# EasyEDA schematic 立创EDA原理图.json
TITLE: My_IOT; REV: 1.0; Date: 2020-11-04; Sheet: 1/1; Company: HNISC
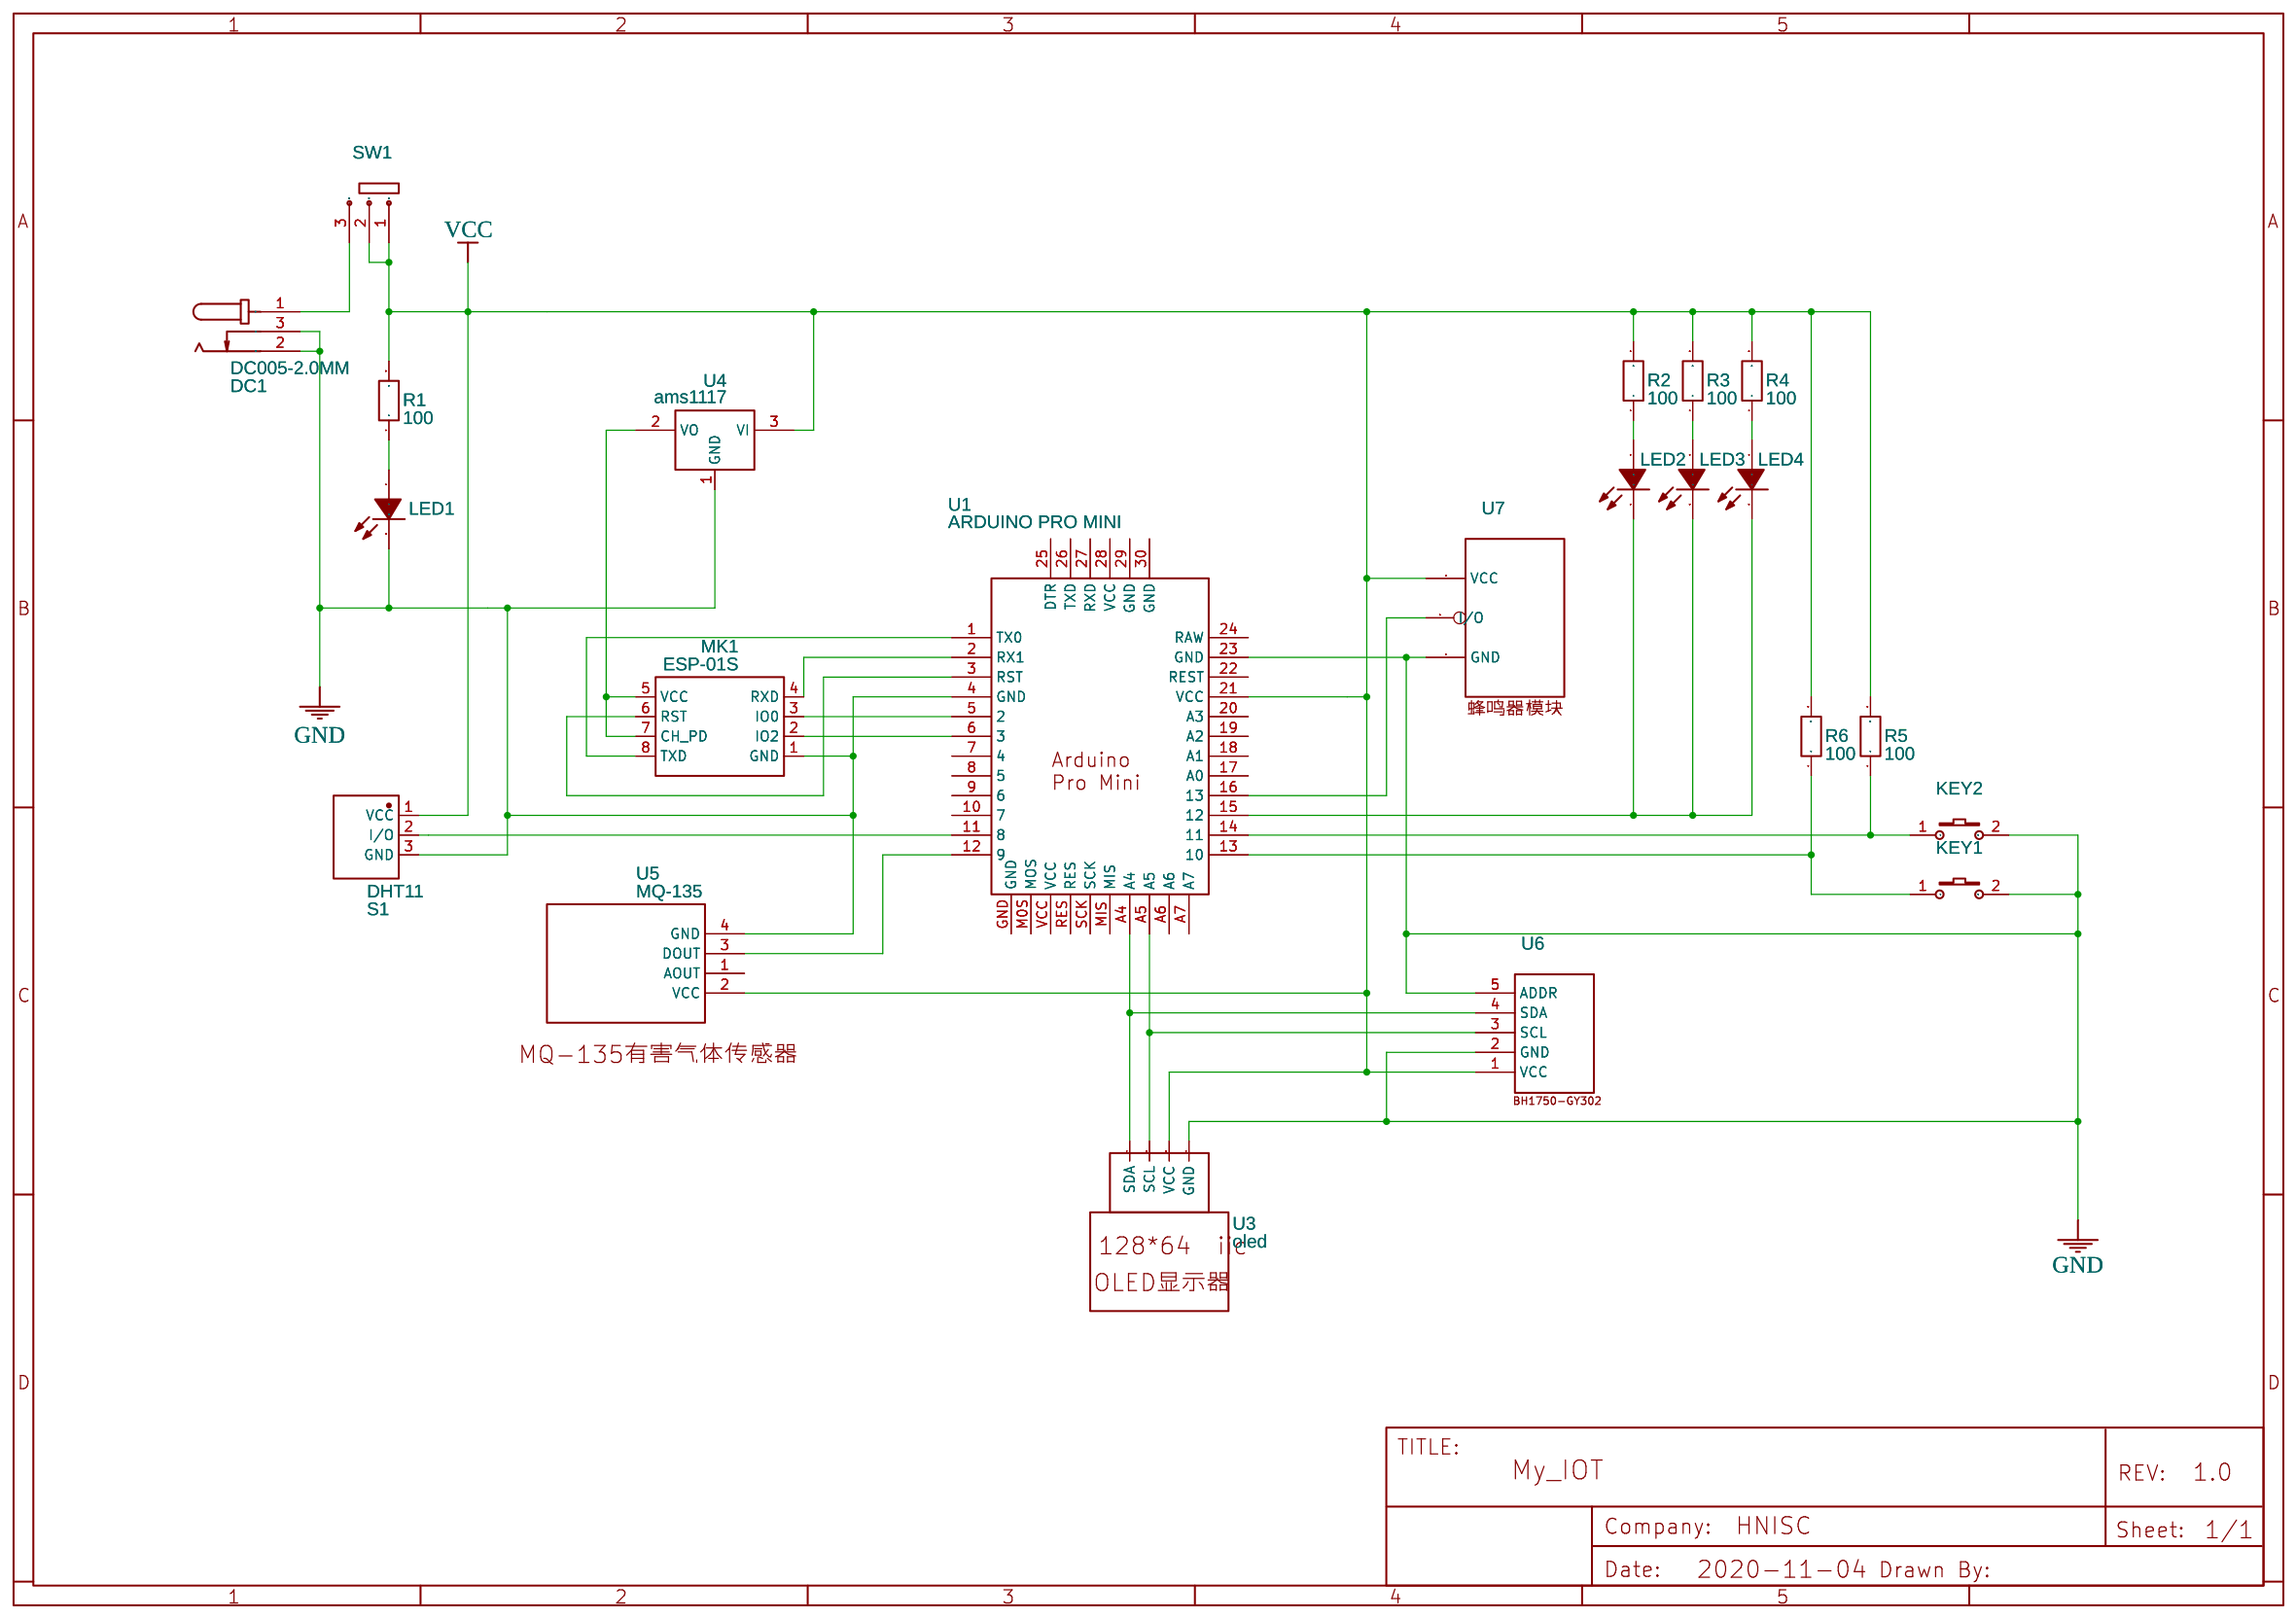
[diagram p0: schematic sheet]

## Parts
DC1  DC005-2.0MM  [DC-IN-TH_DC005]
KEY1  K2-3.6×6.1_SMD  [KEY-SMD_2P-L6.2-W3.6-LS8.0]
KEY2  K2-3.6×6.1_SMD  [KEY-SMD_2P-L6.2-W3.6-LS8.0]
LED1  11-21/G6C-FN2P2B/2T  [LED1206-R-RD]
LED2  11-21/G6C-FN2P2B/2T  [LED1206-R-RD]
LED3  11-21/G6C-FN2P2B/2T  [LED1206-R-RD]
LED4  11-21/G6C-FN2P2B/2T  [LED1206-R-RD]
MK1  ESP-01S  [ESP-01S]
R1  100  [R0603]
R2  100  [R0603]
R3  100  [R0603]
R4  100  [R0603]
R5  100  [R0603]
R6  100  [R0603]
S1  DHT11  [DHT11]
SW1  K3-1235S-L1  [SW-TH_K3-1235S-L1]
U1  ARDUINO PRO MINI  [ARDUINO PRO MINI]
U3  oled  [IIC OLED 128*64]
U4  ams1117  [AMS1117]
U5  MQ-135  [MQ-135_NEW]
U6  BH1750光照度传感器  [BH1750 (GY-302)]
U7  蜂鸣器  [蜂鸣器模块]

## Library data of the parts
DC1 = DC005-2.0MM: Supplier: LCSC; Manufacturer: SOFNG; Supplier Part: C111567
KEY1 KEY2 = K2-3.6×6.1_SMD: Supplier Part: C118141; Supplier: LCSC; Manufacturer Part: K2-1107ST-A4SW-06; Contributor: LCEDA_Lib; 制造商: 韩国韩荣
LED1-LED4 = 11-21/G6C-FN2P2B/2T: Supplier: LCSC; Supplier Part: C264319; Manufacturer: Everlight Elec; Contributor: LCSC
MK1 = ESP-01S: Supplier Part: C82893; Supplier: LCSC; Manufacturer: Ai-Thinker
R1-R6 = R_0603_EU: Contributor: LCEDA_Lib
S1 = DHT11: EasyEDA: E87032; Supplier Part: E87032; Supplier: EasyEDA; Manufacturer: EasyEDA
SW1 = K3-1235S-L1: Supplier: LCSC; Supplier Part: C223838; Manufacturer: Korean Hroparts Elec; Contributor: LCSC
U1 = ARDUINO PRO MINI: Manufacturer Part: Arduino Pro Mini China; link: 淘宝上的廉价mini; Contributor: heroistired
U3 = oled: Contributor: 晓阳生团队
U4 = ams1117: sourceId: _OoGYgCK2k
U5 = MQ-135: Contributor: dggd1314
U6 = BH1750光照度传感器: Contributor: Guest
U7 = 蜂鸣器: Contributor: Weadrom

## Nets
GND: DC1.2 DC1.3 KEY1.2 KEY2.2 LED1.2(K) MK1.1(GND) S1.3(GND) U1.4(GND) U1.23(GND) U3.1(GND) U4.1(GND) U5.4(GND) U6.2(GND) U6.5(ADDR) U7.1(GND)
VCC: R1.2 R2.2 R3.2 R4.2 R5.2 R6.2 S1.1(VCC) SW1.1 SW1.2 U1.21(VCC) U3.2(VCC) U4.3(VI) U5.2(VCC) U6.1(VCC) U7.3(VCC)
Net-(DC1-1): DC1.1 SW1.3
Net-(KEY1-1): KEY1.1 R6.1 U1.13(10)
Net-(KEY2-1): KEY2.1 R5.1 U1.14(11)
Net-(LED1-1): LED1.1(A) R1.1
Net-(LED2-1): LED2.1(A) R2.1
Net-(LED2-2): LED2.2(K) LED3.2(K) LED4.2(K) U1.15(12)
Net-(LED3-1): LED3.1(A) R3.1
Net-(LED4-1): LED4.1(A) R4.1
Net-(MK1-2): MK1.2(IO2) U1.6(3)
Net-(MK1-3): MK1.3(IO0) U1.5(2)
Net-(MK1-4): MK1.4(RXD) U1.2(RX1)
Net-(MK1-5): MK1.5(VCC) MK1.7(CH_PD) U4.2(VO)
Net-(MK1-6): MK1.6(RST) U1.3(RST)
Net-(MK1-8): MK1.8(TXD) U1.1(TX0)
Net-(S1-2): S1.2(I/O) U1.11(8)
Net-(U1-12): U1.12(9) U5.3(DOUT)
Net-(U1-16): U1.16(13) U7.2(I/O)
Net-(U1-A4): U1.A4 U3.4(SDA) U6.4(SDA)
Net-(U1-A5): U1.A5 U3.3(SCL) U6.3(SCL)

Not connected (* = marked no-connect by the designer): U1 7(4) 8(5) 9(6) 10(7) 17(A0) 18(A1) 19(A2) 20(A3) 22(REST) 24(RAW) 25(DTR) 26(TXD) 27(RXD) 28(VCC) 29(GND) 30(GND) A6 A7 GND M0S(MOS) MIS RES SCK VCC; U5 1(AOUT)
